# Altium schematic sheet IAIf1Doc.SchDoc
size A4
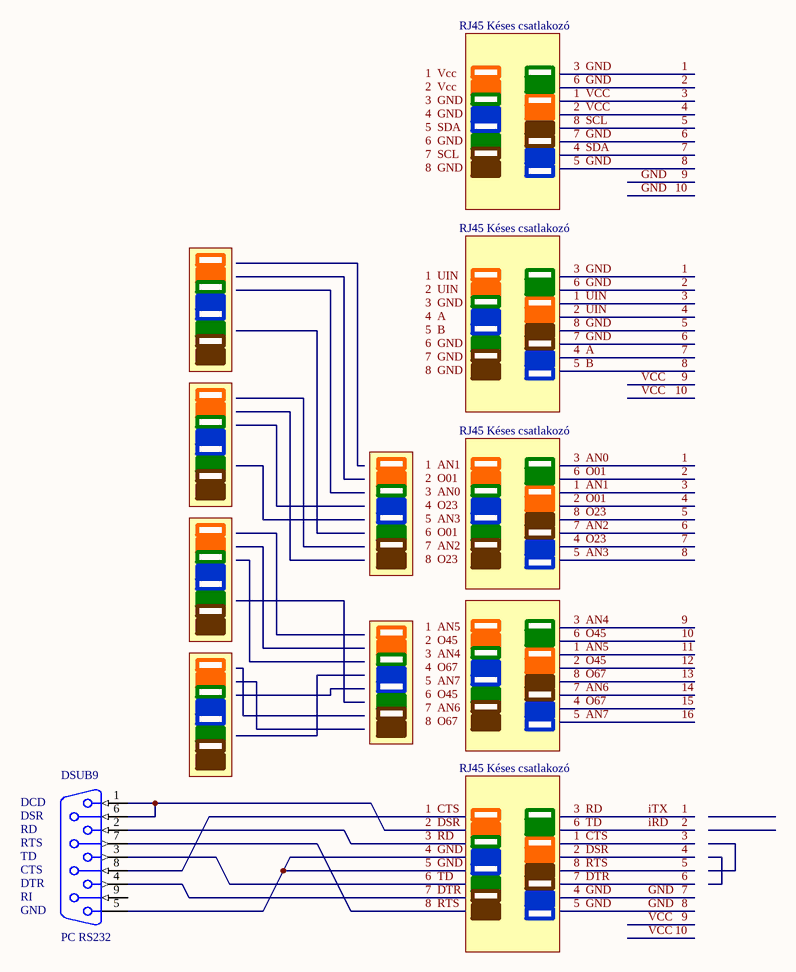
[diagram p0: IAIf1Doc.SchDoc]

## Parts
DSUB9  PC RS232  [DSUB1.385-2H9]

## Nets
1: DSUB9.2  [also labelled 3  AN0, 3  GND, 3  RD, iTX]
1  AN1: DSUB9.8  [also labelled 1  CTS, 1  UIN, 1  VCC, 3]
2: DSUB9.3  [also labelled 6  GND, 6  O01, 6  TD, iRD]
2  DSR: DSUB9.1 DSUB9.6  [also labelled 2  O01, 2  UIN, 2  VCC, 4]
5: DSUB9.7  [also labelled 8  GND, 8  O23, 8  RTS, 8  SCL]
6: DSUB9.4  [also labelled 7  AN2, 7  DTR, 7  GND]
10: DSUB9.5  [also labelled 3  AN4, 4  A, 4  GND, 4  O23, 4  SDA, 5  AN3, 5  B, 5  GND, 6  O45, 7, 8, 9, GND, VCC]

Not connected (* = marked no-connect by the designer): DSUB9 9

## Notes on the sheet
- RJ45 Késes csatlakozó
- DCD
- DSR
- RD
- RTS
- TD
- CTS
- DTR
- GND
- RI
- Labels drawn without touching a wire or pin: 1  AN1, 1  AN5, 1  UIN, 1  Vcc, 2  O01, 2  O45, 2  UIN, 2  Vcc, 3  AN0, 3  AN4, 3  GND, 4  A, 4  GND, 4  O23, 4  O67, 5  AN3, 5  AN7, 5  B, 5  SDA, 6  GND, 6  O01, 6  O45, 7  AN2, 7  AN6, 7  GND, 7  SCL, 8  GND, 8  O23, 8  O67

## Library data of the parts
DSUB9 = D Connector 9: Receptacle Assembly, 9 Position, Right Angle; Package Information: Latest Revision: O; Positions: 9; Published: 15-Jun-2001; Revision: 17-Jul-2002: Re-released for DXP Platform.; Datasheet: (1-Sep-1999); Package Reference: 788750; Publisher: Altium Limited; Orientation: Right Angle; Gender: Receptacle